# Altium schematic sheet Niner.SchDoc
size A; SheetNumber: 1; SheetTotal: 2
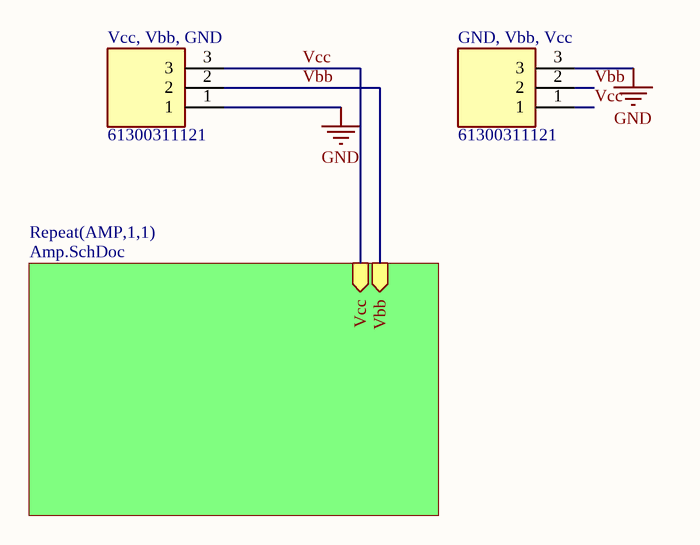
[diagram p0: Niner.SchDoc]

## Parts
GND,_Vbb,_Vcc  61300311121  [HDRV3W64P0X254_1X3_762X254X869P]
Vcc,_Vbb,_GND  61300311121  [HDRV3W64P0X254_1X3_762X254X869P]

## Sub-sheets
Repeat(AMP,1,1) = Amp.SchDoc: Vcc (in), Vbb (in)

## Nets
GND: GND,_Vbb,_Vcc.3 Vcc,_Vbb,_GND.1
Vbb: GND,_Vbb,_Vcc.2 Vcc,_Vbb,_GND.2 ; sheet Repeat(AMP,1,1)/Vbb
Vcc: GND,_Vbb,_Vcc.1 Vcc,_Vbb,_GND.3 ; sheet Repeat(AMP,1,1)/Vcc

## Library data of the parts
GND,_Vbb,_Vcc Vcc,_Vbb,_GND = 61300311121: Connector; Manufacturer_Name: Wurth Elektronik; Datasheet Link: http://katalog.we-online.de/em/datasheet/6130xx11121.pdf; Height: 8.69mm; Manufacturer_Part_Number: 61300311121; Mouser Part Number: 710-61300311121; Mouser Price/Stock: https://www.mouser.co.uk/ProductDetail/Wurth-Elektronik/61300311121?qs=PhR8RmCirEYxRWFJzNKsUw%3D%3D